# Altium schematic sheet Sheet1.SchDoc
size A4; PageSetup: Record=PageOptions|CenterHorizontal=True|CenterVertical=True|PrintScale=0.94|XCorrection=1.00|YCorrection=1.00|PrintKind=0|BorderSize=5000000|LeftOffset=0|BottomOffset=0|Orientation=2|PaperLength=1000|PaperWidth=1000|Scale=100|PaperSource=7|PrintQuality=-3|MediaType=1|DitherType=10|PrintScaleMode=1|PaperKind=Letter|PaperIndex=1
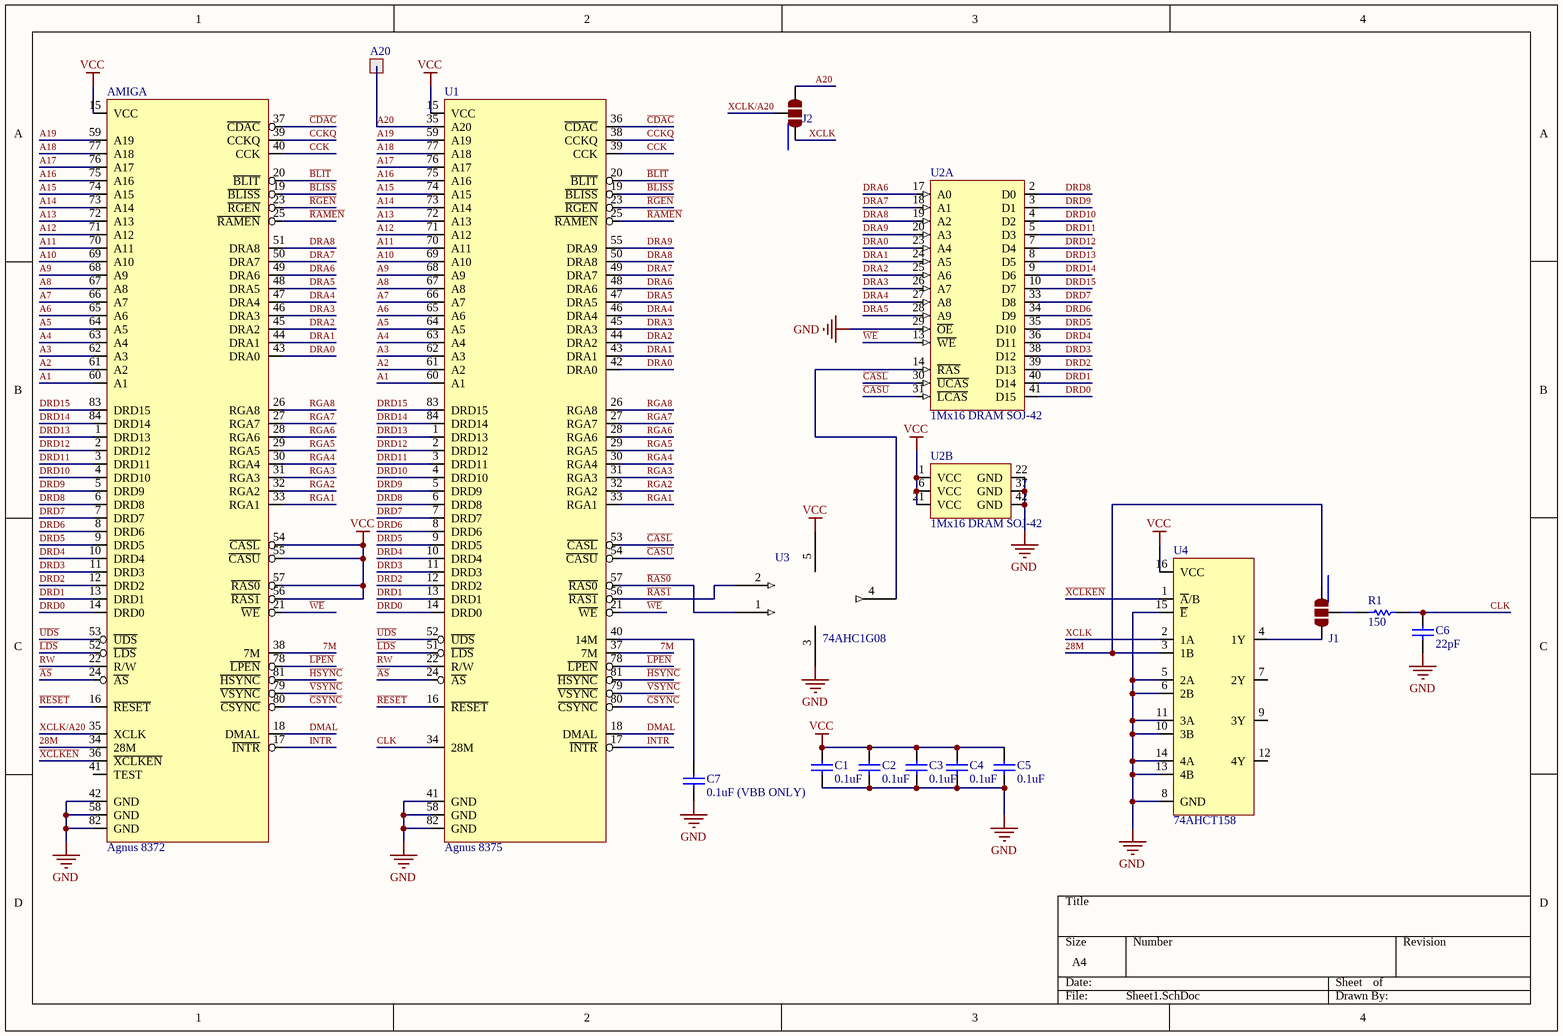
[diagram p0: Sheet1.SchDoc]

## Parts
A20  Molex 90120-0761  [PCB-u1j2a009byds4mriae4x-1]  (value not drawn)
AMIGA  Agnus 8372  [PLCC Male plug]
C1  0.1uF  [CAPC2013X94X50NL20T25]
C2  0.1uF  [CAPC2013X94X50NL20T25]
C3  0.1uF  [CAPC2013X94X50NL20T25]
C4  0.1uF  [CAPC2013X94X50NL20T25]
C5  0.1uF  [CAPC2013X94X50NL20T25]
C6  22pF  [CAPC2013X140X50NL20T25]
C7  0.1uF (VBB ONLY)  [CAPC2013X94X50NL20T25]
J1  H1  [PCB-rrnqmtokqinrd1vbp5jt-1]  (value not drawn)
J2  H1  [PCB-rrnqmtokqinrd1vbp5jt-1]  (value not drawn)
R1  150  [RESC2013X60X30NL20T20]
U1  Agnus 8375  [PCBComponent_1]
U2  1Mx16 DRAM SOJ-42  [SOP42]  (parts A,B of 2)
U3  74AHC1G08  [PCB-hs9ieo8jn20xo1glw5j0-1]
U4  74AHCT158  [PCB-c1qa6rkk0qsamo5yebiy-1]

## Nets
GND: AMIGA.42(GND) AMIGA.58(GND) AMIGA.82(GND) C1.1 C2.1 C3.1 C4.1 C5.1 C6.1 C7.1 U1.41(GND) U1.58(GND) U1.82(GND) U2.22(GND) U2.29(~{OE}) U2.37(GND) U2.42(GND) U3.3(GND) U4.5(2A) U4.6(2B) U4.8(GND) U4.10(3B) U4.11(3A) U4.13(4B) U4.14(4A) U4.15(~{E})
VCC: AMIGA.15(VCC) AMIGA.54(~{CASL}) AMIGA.55(~{CASU}) AMIGA.56(~{RAS1}) AMIGA.57(~{RAS0}) C1.2 C2.2 C3.2 C4.2 C5.2 U1.15(VCC) U2.1(VCC) U2.6(VCC) U2.21(VCC) U3.5(VCC) U4.16(VCC)
7M: AMIGA.38(7M) U1.37(7M)
28M: AMIGA.34(28M) J1.1 U4.3(1B)
A1: AMIGA.60(A1) U1.60(A1)
A2: AMIGA.61(A2) U1.61(A2)
A3: AMIGA.62(A3) U1.62(A3)
A4: AMIGA.63(A4) U1.63(A4)
A5: AMIGA.64(A5) U1.64(A5)
A6: AMIGA.65(A6) U1.65(A6)
A7: AMIGA.66(A7) U1.66(A7)
A8: AMIGA.67(A8) U1.67(A8)
A9: AMIGA.68(A9) U1.68(A9)
A10: AMIGA.69(A10) U1.69(A10)
A11: AMIGA.70(A11) U1.70(A11)
A12: AMIGA.71(A12) U1.71(A12)
A13: AMIGA.72(A13) U1.72(A13)
A14: AMIGA.73(A14) U1.73(A14)
A15: AMIGA.74(A15) U1.74(A15)
A16: AMIGA.75(A16) U1.75(A16)
A17: AMIGA.76(A17) U1.76(A17)
A18: AMIGA.77(A18) U1.77(A18)
A19: AMIGA.59(A19) U1.59(A19)
A20: A20.1 J2.3 U1.35(A20)
~{AS}: AMIGA.24(~{AS}) U1.24(~{AS})
~{BLISS}: AMIGA.19(~{BLISS}) U1.19(~{BLISS})
~{BLIT}: AMIGA.20(~{BLIT}) U1.20(~{BLIT})
~{CASL}: U1.53(~{CASL}) U2.30(~{UCAS})
~{CASU}: U1.54(~{CASU}) U2.31(~{LCAS})
~{CDAC}: AMIGA.37(~{CDAC}) U1.36(~{CDAC})
~{CSYNC}: AMIGA.80(~{CSYNC}) U1.80(~{CSYNC})
CCK: AMIGA.40(CCK) U1.39(CCK)
CCKQ: AMIGA.39(CCKQ) U1.38(CCKQ)
CLK: C6.2 R1.2 U1.34(28M)
DMAL: AMIGA.18(DMAL) U1.18(DMAL)
DRA0: AMIGA.43(DRA0) U1.42(DRA0) U2.23(A4)
DRA1: AMIGA.44(DRA1) U1.43(DRA1) U2.24(A5)
DRA2: AMIGA.45(DRA2) U1.44(DRA2) U2.25(A6)
DRA3: AMIGA.46(DRA3) U1.45(DRA3) U2.26(A7)
DRA4: AMIGA.47(DRA4) U1.46(DRA4) U2.27(A8)
DRA5: AMIGA.48(DRA5) U1.47(DRA5) U2.28(A9)
DRA6: AMIGA.49(DRA6) U1.48(DRA6) U2.17(A0)
DRA7: AMIGA.50(DRA7) U1.49(DRA7) U2.18(A1)
DRA8: AMIGA.51(DRA8) U1.50(DRA8) U2.19(A2)
DRA9: U1.55(DRA9) U2.20(A3)
DRD0: AMIGA.14(DRD0) U1.14(DRD0) U2.41(D15)
DRD1: AMIGA.13(DRD1) U1.13(DRD1) U2.40(D14)
DRD2: AMIGA.12(DRD2) U1.12(DRD2) U2.39(D13)
DRD3: AMIGA.11(DRD3) U1.11(DRD3) U2.38(D12)
DRD4: AMIGA.10(DRD4) U1.10(DRD4) U2.36(D11)
DRD5: AMIGA.9(DRD5) U1.9(DRD5) U2.35(D10)
DRD6: AMIGA.8(DRD6) U1.8(DRD6) U2.34(D9)
DRD7: AMIGA.7(DRD7) U1.7(DRD7) U2.33(D8)
DRD8: AMIGA.6(DRD8) U1.6(DRD8) U2.2(D0)
DRD9: AMIGA.5(DRD9) U1.5(DRD9) U2.3(D1)
DRD10: AMIGA.4(DRD10) U1.4(DRD10) U2.4(D2)
DRD11: AMIGA.3(DRD11) U1.3(DRD11) U2.5(D3)
DRD12: AMIGA.2(DRD12) U1.2(DRD12) U2.7(D4)
DRD13: AMIGA.1(DRD13) U1.1(DRD13) U2.8(D5)
DRD14: AMIGA.84(DRD14) U1.84(DRD14) U2.9(D6)
DRD15: AMIGA.83(DRD15) U1.83(DRD15) U2.10(D7)
~{HSYNC}: AMIGA.81(~{HSYNC}) U1.81(~{HSYNC})
INTR: AMIGA.17(~{INTR}) U1.17(~{INTR})
~{LDS}: AMIGA.52(~{LDS}) U1.51(~{LDS})
~{LPEN}: AMIGA.78(~{LPEN}) U1.78(~{LPEN})
~{RAMEN}: AMIGA.25(~{RAMEN}) U1.25(~{RAMEN})
~{RAS0}: U1.57(~{RAS0}) U3.1(B)
~{RAS1}: U1.56(~{RAS1}) U3.2(A)
~{RESET}: AMIGA.16(~{RESET}) U1.16(~{RESET})
~{RGEN}: AMIGA.23(~{RGEN}) U1.23(~{RGEN})
RGA1: AMIGA.33(RGA1) U1.33(RGA1)
RGA2: AMIGA.32(RGA2) U1.32(RGA2)
RGA3: AMIGA.31(RGA3) U1.31(RGA3)
RGA4: AMIGA.30(RGA4) U1.30(RGA4)
RGA5: AMIGA.29(RGA5) U1.29(RGA5)
RGA6: AMIGA.28(RGA6) U1.28(RGA6)
RGA7: AMIGA.27(RGA7) U1.27(RGA7)
RGA8: AMIGA.26(RGA8) U1.26(RGA8)
RW: AMIGA.22(R/W) U1.22(R/W)
~{UDS}: AMIGA.53(~{UDS}) U1.52(~{UDS})
~{VSYNC}: AMIGA.79(~{VSYNC}) U1.79(~{VSYNC})
~{WE}: AMIGA.21(~{WE}) U1.21(~{WE}) U2.13(~{WE})
~{XCLKEN}: AMIGA.36(~{XCLKEN}) U4.1(~{A}/B)
XCLK: J2.1 U4.2(1A)
XCLK/A20: AMIGA.35(XCLK) J2.2
NetC7_2: C7.2 U1.40(14M)
NetJ1_2: J1.2 R1.1
NetJ1_3: J1.3 U4.4(1Y)
NetU2_14: U2.14(~{RAS}) U3.4(Y)

Not connected (* = marked no-connect by the designer): AMIGA 41(TEST); U4 7(2Y) 9(3Y) 12(4Y)

## Library data of the parts
A20 = CMP-b48f7df16db76b48-3: 2.54mm (.100") Pitch C-Grid III Header, Single Row, Vertical, 40 Circuits, Gold (Au) Plating; Gender: Male; Current Rating: 3.00 A; Halogen Free Status: Not Reviewed; Manufacturer Part Number: 90120-0761; Lifecycle Status: Not Listed by Manufacturer; Contact Material: Brass; OctopartID: b48f7df16db76b48; Orientation: Vertical; RoHS: Compliant; Mounting Style: Through Hole, Vertical
AMIGA = CMP-efwu862vrdu0d84ikc4y-6: 1MB Agnus (A500/2000)
C1-C5 C7 = CMP-126070-2: CAP CER 0.1UF 25V Y5V 0805; Manufacturer Part Number: 08053G104ZAT2A; Capacitance: 1e-07 F; Capacitance Tolerance: +80/-20%; Case/Package (SI): 2012; Lead-Free Status: Lead Free; Voltage Rating (DC): 25.0 V; Case/Package: 0805; Dielectric Characteristic: Y5V; Mounting Style: Surface Mount; Number of Pins: 2; Octopart Url: https://octopart.com/08053g104zat2a-avx+interconnect+%2F+elco-194972; OctopartID: 3033f93becc9eff4; Packaging: Cut Tape (CT); REACH SVHC Compliance: No SVHC; RoHS: Compliant; Size-Height: 0.00071 m; Size-Length: 0.00201 m; Size-Width: 0.00125 m
C6 = CMP-172484-2: CAP CER 22PF 100V 5% NP0 0805; Manufacturer Part Number: 08051A220J4T2A; Capacitance: 2.2e-11 F; Case/Package (SI): 2012; Dielectric Characteristic: C0G/NP0; Lead-Free Status: Lead Free; Voltage Rating (DC): 100.0 V; Capacitance Tolerance: ±5%; Case/Package: 0805; Number of Pins: 2; Octopart Url: https://octopart.com/08051a220j4t2a-avx+interconnect+%2F+elco-7988275; OctopartID: f5963ce534c32a51; Packaging: Tape; RoHS: Compliant
J1 J2 = CMP-0rfjo47dqw9gp5mzow1m-3: SMD Jumper; CustomComponentID: 0rfjo47dqw9gp5mzow1m
R1 = CMP-2823328-2: Res Thick Film 0805 150 Ohm 1% 1/8W ±100ppm/C Molded SMD SMD Punched Paper T/R; Manufacturer Part Number: RK73H2ATTD1500F; Case/Package (SI): 2012; Lead-Free Status: Lead Free; Power Rating: 0.125 W; Resistance: 150.0 Ω; Temperature Coefficient: 100.0 ppm/°C; Voltage Rating (DC): 150.0 V; Case/Package: 0805; Mounting Style: Surface Mount; Number of Pins: 2; Octopart Url: https://octopart.com/rk73h2attd1500f-koa+speer-2167349; OctopartID: c51f0c34f24c1ad8; Packaging: Cut Tape (CT); Resistance Tolerance: ±1%; RoHS: Compliant; Size-Length: 0.002 m; Size-Width: 0.00125 m
U1 = CMP-7khi6ttu66jii6hcxoo5-4: 2MB Agnus (A500+/A600)
U2 = CMP-upz9ayrn6n7gqqnzejzn-3: Generic 5V 16Mbit EDO DRAM SOJ42; CustomComponentID: upz9ayrn6n7gqqnzejzn
U3 = CMP-eb1b2368527234dc-4: Logic, And Gate, Single, 2 i/p, Tssop-5
U4 = CMP-483e8585f23297f9-2: 74AHC Series 2 to 5.5 V Quad 2-Input Multiplexer Surface Mount - SOIC-16; Manufacturer Part Number: 74AHC157D,112; Lead-Free Status: Lead Free; Supply Voltage (DC): 5.50 V (max), 2.00 V (min); Operating Temperature: -40.0 °C (min); Octopart URL: https://octopart.com/74ahc157d%2C112-nexperia-78749546; Lifecycle Status: Active; Packaging: Cut Tape (CT); REACH SVHC Compliance: No SVHC; RoHS: Compliant; OctopartID: 483e8585f23297f9; Mounting Style: Surface Mount; Number of Pins: 16